# Altium schematic sheet UniConnector.SchDoc
size A; SheetNumber: 4; SheetTotal: 5
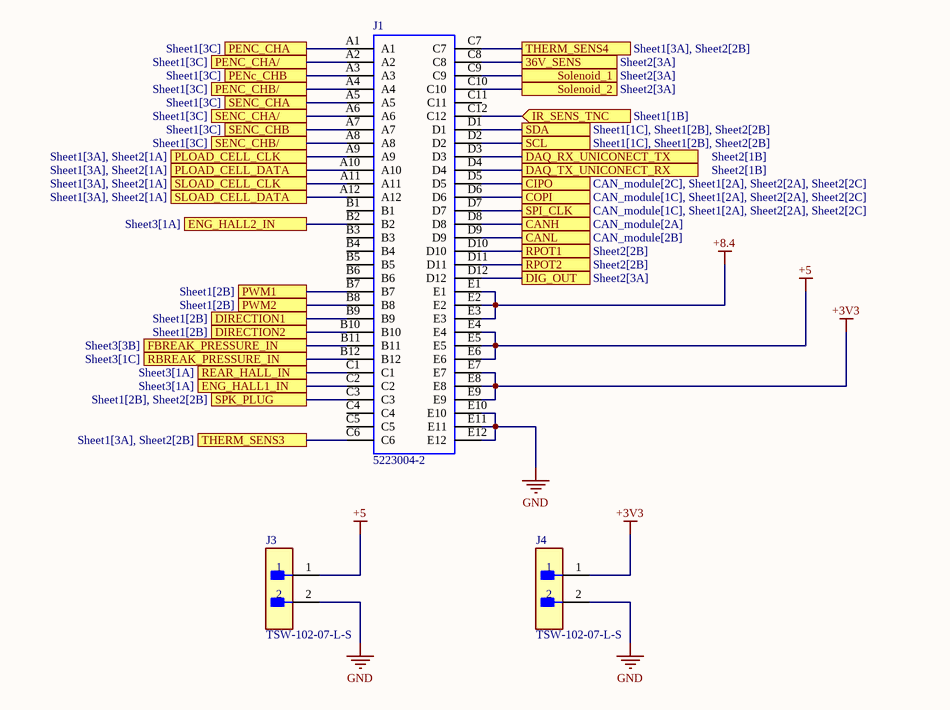
[diagram p0: UniConnector.SchDoc]

## Parts
J1  5223004-2  [52230042]
J3  TSW-102-07-L-S  [FP-TSW-102-07-L-S-MFG]
J4  TSW-102-07-L-S  [FP-TSW-102-07-L-S-MFG]

## Ports
36V_SENS (see Sheet2[3A]), CANH (see CAN_module[2A]), CANL (see CAN_module[2B]), CIPO (see CAN_module[2C], Sheet1[2A], Sheet2[2A], Sheet2[2C]), COPI (see CAN_module[1C], Sheet1[2A], Sheet2[2A], Sheet2[2C]), DAQ_RX_UNICONECT_TX (see Sheet2[1B]), DAQ_TX_UNICONECT_RX (see Sheet2[1B]), DIG_OUT (see Sheet2[3A]), DIRECTION1 (see Sheet1[2B]), DIRECTION2 (see Sheet1[2B]), ENG_HALL1_IN (see Sheet3[1A]), ENG_HALL2_IN (see Sheet3[1A]), FBREAK_PRESSURE_IN (see Sheet3[3B]), IR_SENS_TNC (in, see Sheet1[1B]), PENC_CHA (see Sheet1[3C]), PENC_CHA/ (see Sheet1[3C]), PENc_CHB (see Sheet1[3C]), PENC_CHB/ (see Sheet1[3C]), PLOAD_CELL_CLK (see Sheet1[3A], Sheet2[1A]), PLOAD_CELL_DATA (see Sheet1[3A], Sheet2[1A]), PWM1 (see Sheet1[2B]), PWM2 (see Sheet1[2B]), RBREAK_PRESSURE_IN (see Sheet3[1C]), REAR_HALL_IN (see Sheet3[1A]), RPOT1 (see Sheet2[2B]), RPOT2 (see Sheet2[2B]), SCL (see Sheet1[1C], Sheet1[2B], Sheet2[2B]), SDA (see Sheet1[1C], Sheet1[2B], Sheet2[2B]), SENC_CHA (see Sheet1[3C]), SENC_CHA/ (see Sheet1[3C]), SENC_CHB (see Sheet1[3C]), SENC_CHB/ (see Sheet1[3C]), SLOAD_CELL_CLK (see Sheet1[3A], Sheet2[1A]), SLOAD_CELL_DATA (see Sheet1[3A], Sheet2[1A]), Solenoid_1 (see Sheet2[3A]), Solenoid_2 (see Sheet2[3A]), SPI_CLK (see CAN_module[1C], Sheet1[2A], Sheet2[2A], Sheet2[2C]), SPK_PLUG (see Sheet1[2B], Sheet2[2B]), THERM_SENS3 (see Sheet1[3A], Sheet2[2B]), THERM_SENS4 (see Sheet1[3A], Sheet2[2B])

## Nets
+3V3: J1.E7 J1.E8 J1.E9 J4.1
+5: J1.E4 J1.E5 J1.E6 J3.1
+8.4: J1.E1 J1.E2 J1.E3
GND: J1.E10 J1.E11 J1.E12 J3.2 J4.2
36V_SENS: J1.C8 ; port 36V_SENS
CANH: J1.D8 ; port CANH
CANL: J1.D9 ; port CANL
CIPO: J1.D5 ; port CIPO
COPI: J1.D6 ; port COPI
DAQ_RX_UNICONECT_TX: J1.D3 ; port DAQ_RX_UNICONECT_TX
DAQ_TX_UNICONECT_RX: J1.D4 ; port DAQ_TX_UNICONECT_RX
DIG_OUT: J1.D12 ; port DIG_OUT
DIRECTION1: J1.B9 ; port DIRECTION1
DIRECTION2: J1.B10 ; port DIRECTION2
ENG_HALL1_IN: J1.C2 ; port ENG_HALL1_IN
ENG_HALL2_IN: J1.B2 ; port ENG_HALL2_IN
FBREAK_PRESSURE_IN: J1.B11 ; port FBREAK_PRESSURE_IN
IR_SENS_TNC: J1.C12 ; port IR_SENS_TNC
PENC_CHA: J1.A1 ; port PENC_CHA
PENC_CHA/: J1.A2 ; port PENC_CHA/
PENc_CHB: J1.A3 ; port PENc_CHB
PENC_CHB/: J1.A4 ; port PENC_CHB/
PLOAD_CELL_CLK: J1.A9 ; port PLOAD_CELL_CLK
PLOAD_CELL_DATA: J1.A10 ; port PLOAD_CELL_DATA
PWM1: J1.B7 ; port PWM1
PWM2: J1.B8 ; port PWM2
RBREAK_PRESSURE_IN: J1.B12 ; port RBREAK_PRESSURE_IN
REAR_HALL_IN: J1.C1 ; port REAR_HALL_IN
RPOT1: J1.D10 ; port RPOT1
RPOT2: J1.D11 ; port RPOT2
SCL: J1.D2 ; port SCL
SDA: J1.D1 ; port SDA
SENC_CHA: J1.A5 ; port SENC_CHA
SENC_CHA/: J1.A6 ; port SENC_CHA/
SENC_CHB: J1.A7 ; port SENC_CHB
SENC_CHB/: J1.A8 ; port SENC_CHB/
SLOAD_CELL_CLK: J1.A11 ; port SLOAD_CELL_CLK
SLOAD_CELL_DATA: J1.A12 ; port SLOAD_CELL_DATA
Solenoid_1: J1.C9 ; port Solenoid_1
Solenoid_2: J1.C10 ; port Solenoid_2
SPI_CLK: J1.D7 ; port SPI_CLK
SPK_PLUG: J1.C3 ; port SPK_PLUG
THERM_SENS3: J1.C6 ; port THERM_SENS3
THERM_SENS4: J1.C7 ; port THERM_SENS4

Not connected (* = marked no-connect by the designer): J1 B1 B3 B4 B5 B6 C4 C5 C11

## Library data of the parts
J1 = 5223004-2: Conn Backplane RCP 60 POS 2mm Solder RA Thru-Hole Tube; Manufacturer_Name: TE Connectivity; Geometry.Height: 14mm; Mouser Part Number: 571-5223004-2; Mouser Price/Stock: https://www.mouser.co.uk/ProductDetail/TE-Connectivity/5223004-2?qs=oNRo%252BTjlpTO6tP0xSX%252BI3w%3D%3D; Manufacturer_Part_Number: 5223004-2; Datasheet Link: https://www.te.com/commerce/DocumentDelivery/DDEController?Action=srchrtrv&DocNm=5223004&DocType=Customer+Drawing&DocLang=English
J3 J4 = CMP-02766-001428-1: CONN HEADER VERT 2POS 2.54MM; Voltage Rating: 550V; Current Rating: 7.6A; Gender: Male; Number of Contacts: 2; Connector Type: Male Pin; Radiation Hardening: No; Orientation: Straight; Contact Plating: Gold; Max Operating Temperature: 125°C; Mount: Through Hole; Package Quantity: 1; Number of Rows: 1; Housing Material: Polyester; RoHS Compliant: Yes; Length: 5.08mm; Max Voltage Rating (AC): 550V; Pitch: 2.54mm; Packaging: Bulk; Depth: 2.54mm; Termination: Solder; Min Operating Temperature: -55°C; Housing Color: Black; Lead Free: Lead Free; Color: Black; Number of Positions: 2; Width: 2.54mm; Max Current Rating: 7.6A; REACH SVHC: No SVHC; Contact Material: Bronze; Contact Mating Length: 0.23inch; Series: TSW; Contact Type: Male Pin